# EAGLE design Omnia_SecondBoard (EAGLE 9.7.0)
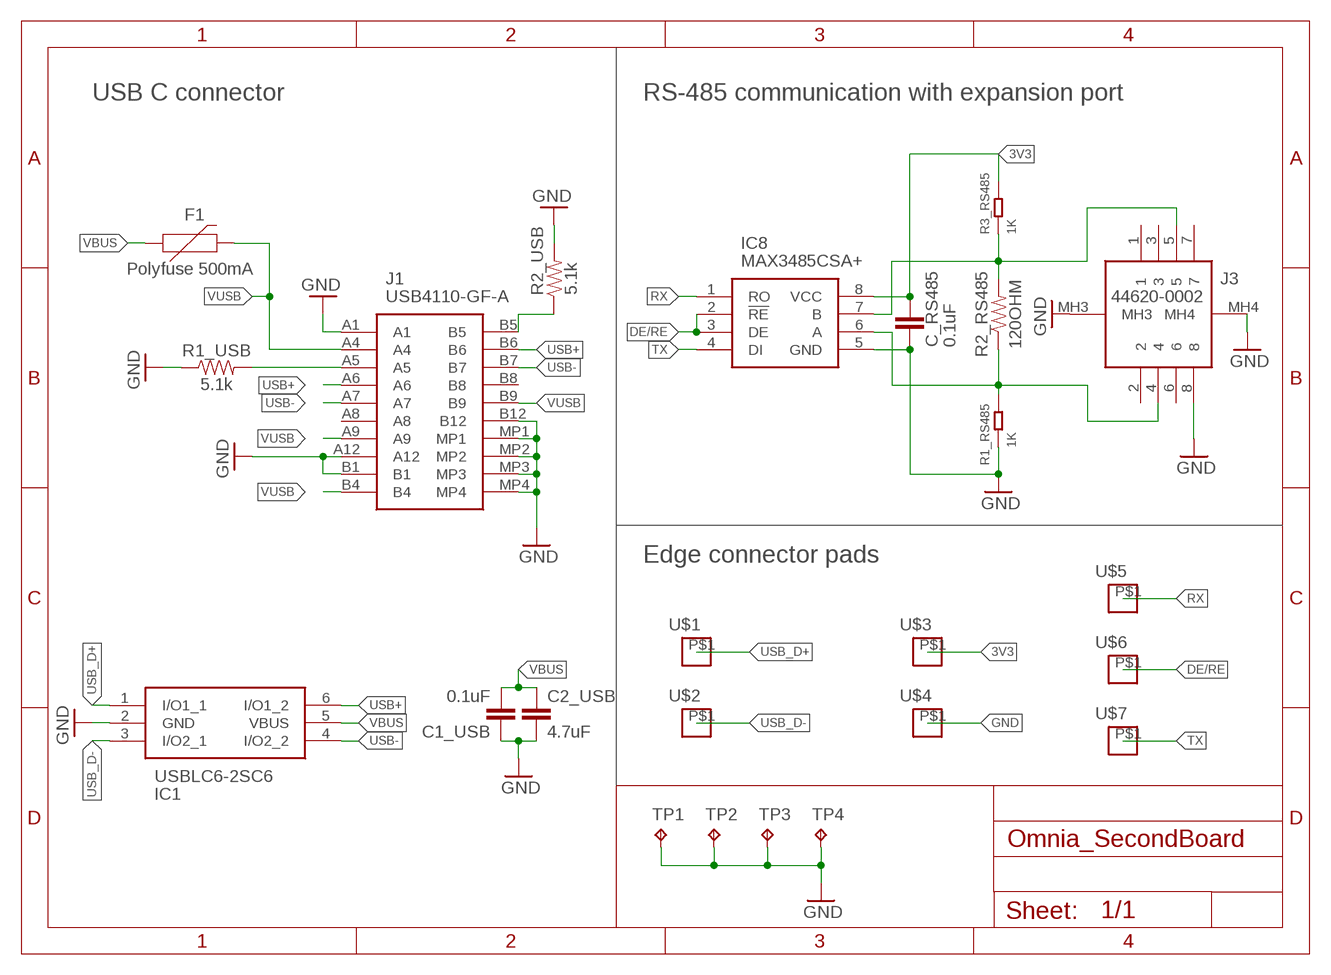
[diagram p0: schematic, sheet 1]

## Parts
C1_USB  0.1uF  0.1UF-0402-16V-10%  [0402]
C2_USB  4.7uF  4.7UF-0603-6.3V-(10%)  [0603]
C_RS485  0.1uF  0.1UF-0402-16V-10%  [0402]
F1  Polyfuse 500mA  PPTC_16V_2.5A  [1812]
IC1  USBLC6-2SC6  [SOT95P280X145-6N]
IC8  MAX3485CSA+  [SOIC127P600X175-8N]
J1  USB4110-GF-A  [USB4110GFA]
J3  44620-0002  [446200002]
R1_RS485  1K  SMD-RES-1K-1%-1/10W(0603)  [R0603]
R1_USB  5.1k  5.1KOHM-0402T-1/16W-1%  [0402-TIGHT]
R2_RS485  120OHM  [0603]
R2_USB  5.1k  5.1KOHM-0402T-1/16W-1%  [0402-TIGHT]
R3_RS485  1K  SMD-RES-1K-1%-1/10W(0603)  [R0603]
TP1  TPTP20SQ  [TP20SQ]
TP2  TPTP20SQ  [TP20SQ]
TP3  TPTP20SQ  [TP20SQ]
TP4  TPTP20SQ  [TP20SQ]
U$1  CUTOUT3  [CUTOUT2]
U$2  CUTOUT3  [CUTOUT2]
U$3  CUTOUT3  [CUTOUT2]
U$4  CUTOUT3  [CUTOUT2]
U$5  CUTOUT3  [CUTOUT2]
U$6  CUTOUT3  [CUTOUT2]
U$7  CUTOUT3  [CUTOUT2]

## Nets
3V3: C_RS485.1 IC8.8(VCC) R3_RS485.2 U$3.P$1(PINHD)
DE/RE: IC8.2(!RE) IC8.3(DE) U$6.P$1(PINHD)
GND: C1_USB.1 C2_USB.2 C_RS485.2 IC1.2(GND) IC8.5(GND) J1.A1 J1.A12 J1.B1 J1.B12 J1.MP1 J1.MP2 J1.MP3 J1.MP4 J3.8 J3.MH3 J3.MH4 R1_RS485.1 R1_USB.1 R2_USB.2 TP1.TP TP2.TP TP3.TP TP4.TP U$4.P$1(PINHD)
N$25: J1.B5 R2_USB.1
N$26: J1.A5 R1_USB.2
N$70: IC8.7(B) J3.5 R2_RS485.2 R3_RS485.1
N$75: IC8.6(A) J3.4 R1_RS485.2 R2_RS485.1
RX: IC8.1(RO) U$5.P$1(PINHD)
TX: IC8.4(DI) U$7.P$1(PINHD)
USB+: IC1.6(I/O1_2) J1.A6 J1.B6
USB-: IC1.4(I/O2_2) J1.A7 J1.B7
USB_D+: IC1.1(I/O1_1) U$1.P$1(PINHD)
USB_D-: IC1.3(I/O2_1) U$2.P$1(PINHD)
VBUS: C1_USB.2 C2_USB.1 F1.1 IC1.5(VBUS)
VUSB: F1.2 J1.A4 J1.A9 J1.B4 J1.B9
Unconnected: J1.A8 J1.B8 J3.1 J3.2 J3.3 J3.6 J3.7

## Notes on the sheet
- USB C connector | RS-485 communication with expansion port
- Edge connector pads

## Library data of the parts
C1_USB C_RS485 = SparkFun-Capacitors:0.1UF: 0.1µF ceramic capacitors A capacitor is a passive two-terminal electrical component used to store electrical energy temporarily in an electric field.; PROD_ID: CAP-12416
C2_USB = SparkFun-Capacitors:4.7UF: 4.7µF ceramic capacitors A capacitor is a passive two-terminal electrical component used to store electrical energy temporarily in an electric field.; PROD_ID: CAP-08280
F1 = SparkFun-Fuses:PPTC: Resettable Fuse PPTC Resettable Fuse. Really a sort of resistor with a polymeric positive temperature coefficient whose resistance increases dramatically with an increase in temperature. When heated by the power passing through the resistance rises causing the current to be limited, protecting the circuit. This is achieved by the transition of the polymer from a crystalline to an amorphous state where the conductive carbon separates breaking the conductive pathways found in the cool crystalline structure. When a PPTC cools back down it resumes conducting letting the circuit turn back on. SparkFun Products: SparkFun RedBoard - Programmed with Arduino <https://www.sparkfun.com/products/12757> Pro Micro - 5V/16MHz <https://www.sparkfun.com/products/12640> Arduino Pro 328 - 5V/16MHz <https://www.sparkfun.com/products/10915> MP3 Trigger <https://www.sparkfun.com/products/13720>; PROD_ID: RES-14390; VALUE: 16V/2.5A(5A TRIP)
IC1 = USBLC6-2SC6:USBLC6-2SC6: TVS Diode Array Uni-Directional USBLC6-2SC6 17V, SOT-23 6-Pin Source: Datasheet <http://www.st.com/st-web-ui/static/active/en/resource/technical/document/datasheet/CD00050750.pdf>; DESCRIPTION: TVS Diode Array Uni-Directional USBLC6-2SC6 17V, SOT-23 6-Pin; HEIGHT: 1.45mm; MANUFACTURER_NAME: STMicroelectronics; MANUFACTURER_PART_NUMBER: USBLC6-2SC6; MOUSER_PART_NUMBER: 511-USBLC6-2SC6; MOUSER_PRICE-STOCK: https://www.mouser.co.uk/ProductDetail/STMicroelectronics/USBLC6-2SC6?qs=po45yt2pPpu%2FhNIlwQdTlg%3D%3D
IC8 = MAX3485CSA+:MAX3485CSA+: MAX3485CSA+, Line Transceiver, RS-485, RS-422 10 Mbit/s Differential, 3.3 V, 8-Pin SOIC Source: Datasheet <http://datasheets.maximintegrated.com/en/ds/MAX3483-MAX3491.pdf>; DESCRIPTION: MAX3485CSA+, Line Transceiver, RS-485, RS-422 10 Mbit/s Differential, 3.3 V, 8-Pin SOIC; HEIGHT: 1.75mm; MANUFACTURER_NAME: Analog Devices; MANUFACTURER_PART_NUMBER: MAX3485CSA+
J1 = USB4110-GF-A:USB4110-GF-A: CONN USB 2.0 TYPE-C R/A SMT Source: Datasheet <https://gct.co/files/drawings/usb4110.pdf>; DESCRIPTION: CONN USB 2.0 TYPE-C R/A SMT; HEIGHT: 3.26mm; MANUFACTURER_NAME: GCT (GLOBAL CONNECTOR TECHNOLOGY); MANUFACTURER_PART_NUMBER: USB4110-GF-A; MOUSER_PART_NUMBER: 640-USB4110-GF-A; MOUSER_PRICE-STOCK: https://www.mouser.co.uk/ProductDetail/GCT/USB4110-GF-A?qs=KUoIvG%2F9IlYiZvIXQjyJeA%3D%3D
J3 = 44620-0002:44620-0002: Molex Female Cat3 RJ45 Modular Jack, Right Angle, Through Hole Mount, 44620 Source: Datasheet <https://componentsearchengine.com/Datasheets/1/44620-0002.pdf>; DESCRIPTION: Molex Female Cat3 RJ45 Modular Jack, Right Angle, Through Hole Mount, 44620; HEIGHT: 13.46mm; MANUFACTURER_NAME: Molex; MANUFACTURER_PART_NUMBER: 44620-0002; MOUSER_PART_NUMBER: 538-44620-0002; MOUSER_PRICE-STOCK: https://www.mouser.co.uk/ProductDetail/Molex/44620-0002?qs=%2F%2FRC%2FV59VWAflICSfNN4Pw%3D%3D
R1_RS485 R3_RS485 = OPL_Resistor:SMD-RES-1K-1%-1/10W(0603): 301011969; MPN: RC0603FR-071KL
R1_USB R2_USB = SparkFun-Resistors:5.1KOHM; PROD_ID: RES-14340
R2_RS485 = SparkFun-Resistors:120OHM: 120Ω resistor A resistor is a passive two-terminal electrical component that implements electrical resistance as a circuit element. Resistors act to reduce current flow, and, at the same time, act to lower voltage levels within circuits. - Wikipedia
TP1-TP4 = testpad:TP: Test pad
U$1-U$7 = Library_cutout:CUTOUT3

## Board
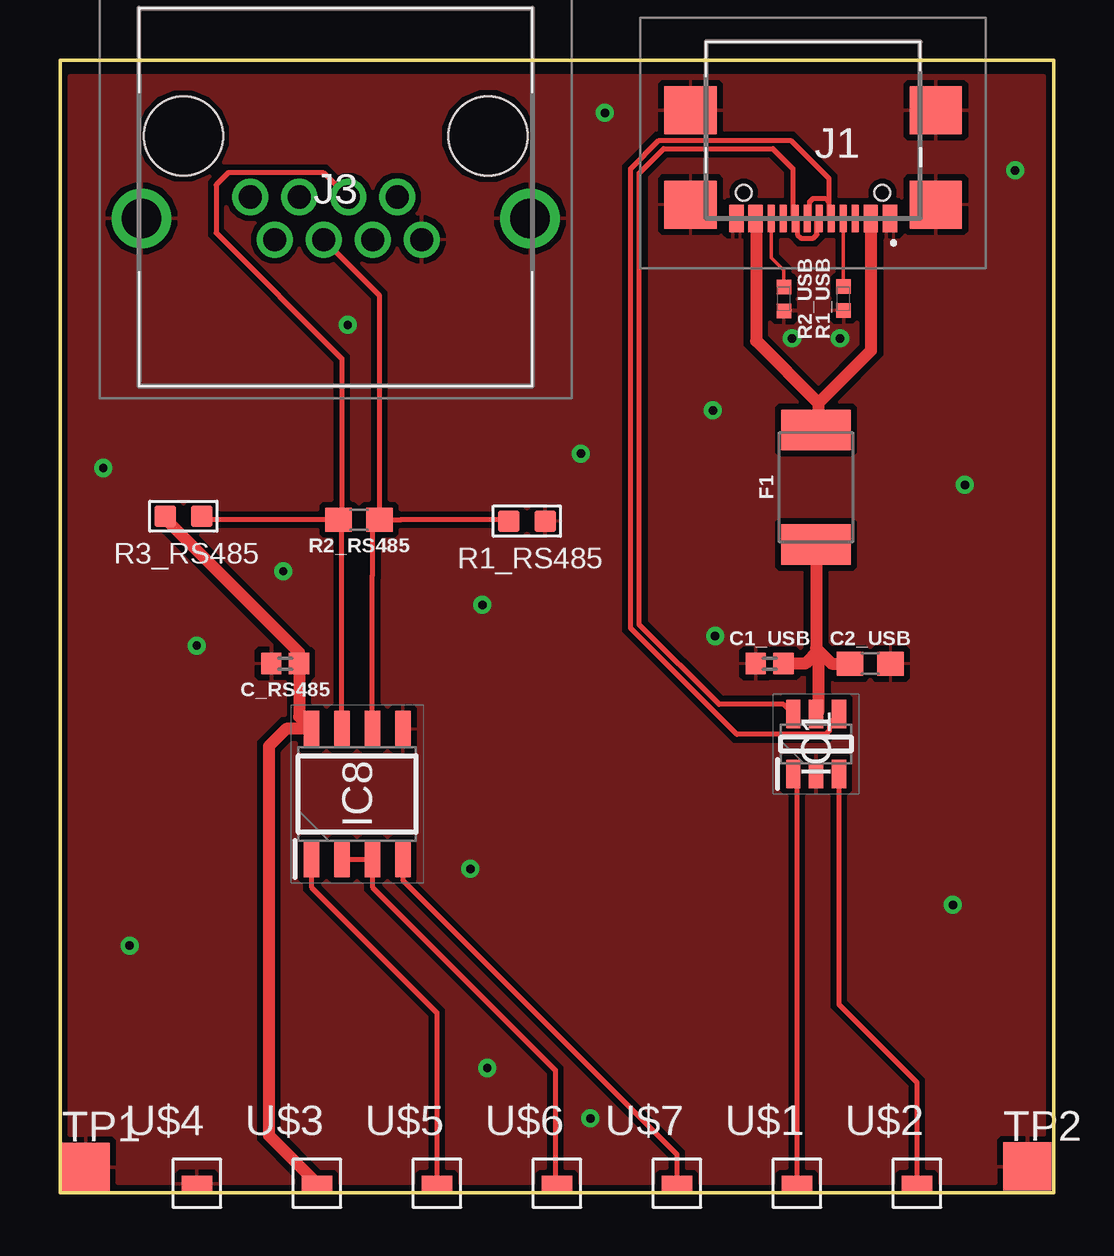
[diagram p1: board, top side]
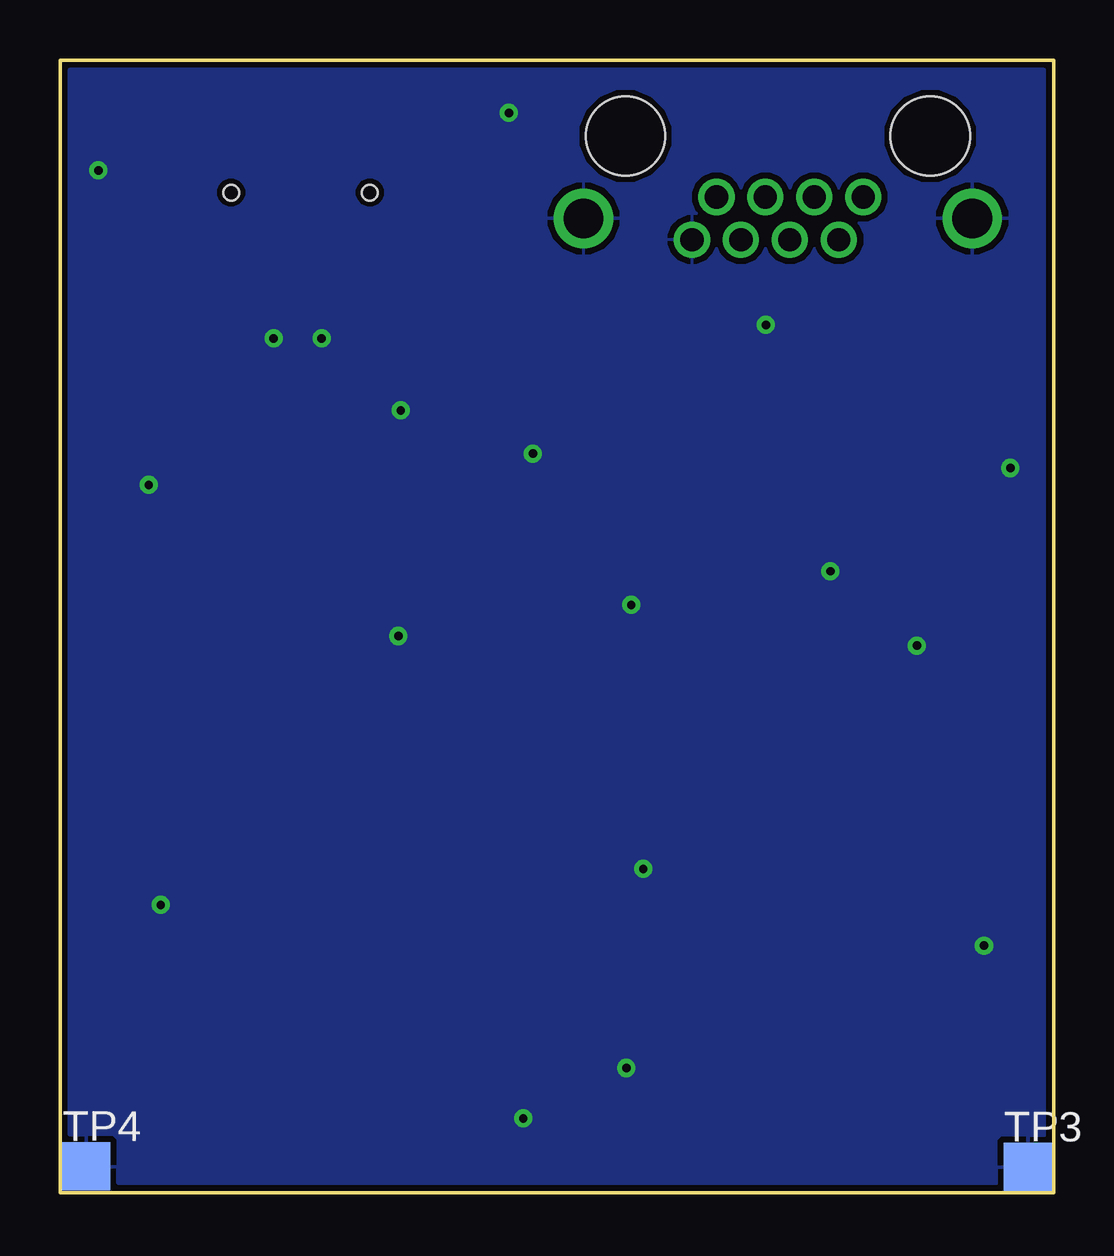
[diagram p2: board, bottom side, seen from below]

Size 41.4 x 47.2 mm. Coordinates in mm from the lower left corner, seen from the top.
Outline: 0,47.2 0,0 41.4,0 41.4,47.2 0,47.2
Copper layers (1*16): Top / Bottom
Stack-up Default Layer Stack: Top User Defined 0.035mm / Dielectric-1 User Defined 1.5mm / Bottom User Defined 0.035mm
Design rules: minimum copper width 6mil, minimum drill size 0.35mm, copper clearance wire_polygon to wire_polygon 6mil, copper clearance wire_polygon to pad_smd 6mil, copper clearance wire_polygon to via 6mil, copper clearance pad_smd to pad_smd 0.152mm, copper clearance pad_smd to via 6mil, copper clearance via to via 6mil, copper clearance smd to pad (same net) 6mil, copper clearance smd to via (same net) 6mil, copper clearance smd to smd (same net) 6mil, dimension clearance 6mil, via restrict clearance 6mil, restrict clearance 6mil, drill distance 6mil, keepout clearance 6mil

### Footprints (pad centres in the part's own frame; a part is rotated, then mirrored left to right if it is on the bottom)
0402 = smd 0.85 x 0.9: 1 -0.58,0; 2 0.58,0
0603 = smd 1.1 x 1: 1 -0.85,0; 2 0.85,0
1812 = smd 1.676 x 2.896: 1 -2.388,0; 2 2.388,0
SOT95P280X145-6N = smd 1.2 x 0.6: 1 -1.25,0.95; 2 -1.25,0; 3 -1.25,-0.95; 4 1.25,-0.95; 5 1.25,0; 6 1.25,0.95
SOIC127P600X175-8N = smd 1.525 x 0.65: 1 -2.712,1.905; 2 -2.712,0.635; 3 -2.712,-0.635; 4 -2.712,-1.905; 5 2.712,-1.905; 6 2.712,-0.635; 7 2.712,0.635; 8 2.712,1.905
USB4110GFA = smd 0.3 x 1.15: A1 -3.35,3.678; A4 -2.55,3.678; A5 -1.25,3.678; A6 -0.25,3.678; A7 0.25,3.678; A8 1.25,3.678; A9 2.55,3.678; A12 3.35,3.678; B1 3.05,3.678; B4 2.25,3.678; B5 1.75,3.678; B6 0.75,3.678; B7 -0.75,3.678; B8 -1.75,3.678; B9 -2.25,3.678; B12 -3.05,3.678 | smd 2.18 x 2: MP1 -5.11,-0.827; MP2 5.11,-0.827; MP3 -5.11,3.103; MP4 5.11,3.103 | hole 0.65: -2.89,2.603; 2.89,2.603
446200002 = drill 0.97 pad 1.509: 1 0,0; 2 -1.02,1.78; 3 -2.04,0; 4 -3.06,1.78; 5 -4.08,0; 6 -5.1,1.78; 7 -6.12,0; 8 -7.14,1.78 | drill 1.65 pad 2.475: MH3 4.54,0.89; MH4 -11.66,0.89 | hole 3.3: 2.79,-2.54; -9.91,-2.54
R0603 = smd 0.889 x 0.889: 1 0,0.762; 2 0,-0.762
0402-TIGHT = smd 0.6 x 0.6: 1 -0.5,0; 2 0.5,0
TP20SQ = smd 2 x 2: TP 0,0
CUTOUT2 = smd 1.27 x 0.635: P$1 0,0

### Placement (x,y rotation side)
C1_USB  29.57,22.05 0 top
C2_USB  33.76,22.05 0 top
C_RS485  9.38,22.05 180 top
F1  31.5,29.4 90 top
IC1  31.5,18.7 90 top
IC8  12.38,16.62 90 top
J1  31.38,44.28 180 top
J3  7.93,41.49 180 top
R1_RS485  19.46,27.99 270 top
R1_USB  32.64,37.26 90 top
R2_RS485  12.46,28.05 180 top
R2_USB  30.16,37.25 270 top
R3_RS485  5.14,28.19 270 top
TP1  1.08,1.08 0 top
TP2  40.3,1.1 0 top
TP3  1.08,1.08 0 bottom
TP4  40.3,1.1 0 bottom
U$1  30.7,0.39 0 top
U$2  35.7,0.39 0 top
U$3  10.7,0.39 0 top
U$4  5.7,0.39 0 top
U$5  15.7,0.39 0 top
U$6  20.7,0.39 0 top
U$7  25.7,0.39 0 top

### Tracks (layer width: path | path; a pad name or v marks a point on that pad's centre or on a via)
3V3
  Top 0.508: R3_RS485.2 4.38,28.09 9.96,22.51 C_RS485.1 9.96,19.85 IC8.8 9.43,19.33 8.7,18.6 8.7,2.39 U$3.P$1
DE/RE
  Top 0.2: IC8.2 IC8.3 13.02,12.73 20.64,5.11 20.64,0.46 U$6.P$1
GND  (via drill 0.35)
  Top 0.2: J1.A12 J1.B1
  other vias: 32.5,35.6 30.5,35.6 27.3,23.2 17.6,24.5 17.1,13.5 5.7,22.8 17.8,5.2 22.1,3.1 9.3,25.9 2.9,10.3 37.2,12 37.7,29.5 27.2,32.6 21.7,30.8 1.8,30.2 39.8,42.6 22.7,45 11.99,36.16
  pour Top (isolate 0.254): -0.3,46.6 -0.3,-0.4 41.7,-0.4 41.7,46.6
  pour Bottom (isolate 0.254): 0.1,48.6 0.1,0 41,0 41.3,0.3 41.3,47.5 40.8,48
N$25
  Top 0.152: J1.B5 29.63,38.97 30.16,38.44 R2_USB.1
N$26
  Top 0.152: J1.A5 R1_USB.2
N$70
  Top 0.2: IC8.7 11.74,27.92 | 11.74,27.92 R2_RS485.2 6.04,28.05 R3_RS485.1 | J3.5 11.99,41.49 10.99,42.5 7,42.5 6.5,42 6.5,40 11.74,34.76 11.74,27.92
N$75
  Top 0.2: R1_RS485.2 18.64,28.04 14.22,28.04 14.22,28.05 R2_RS485.1 | J3.4 13.31,37.39 R2_RS485.1 | IC8.6 13.02,25.72 13.03,25.74 13.03,27.77 R2_RS485.1
RX
  Top 0.2: IC8.1 10.47,12.73 15.7,7.51 U$5.P$1
TX
  Top 0.2: IC8.4 14.29,13.02 25.7,1.6 U$7.P$1
USB+
  Top 0.2: IC1.6 30.15,20.35 27.46,20.35 24.13,23.68 24.13,42.48 25.15,43.5 29.7,43.5 30.53,42.67 30.53,40.7 J1.B6 30.73,40.51 30.73,39.92 30.88,39.78 31.38,39.78 31.53,39.92 31.53,40.51 J1.A6
USB-
  Top 0.2: 32.03,41.28 31.88,41.43 31.38,41.43 31.23,41.28 31.23,40.7 J1.A7 | J1.B7 32.03,40.7 32.03,41.28 | IC1.4 32.05,19.55 32.05,19.25 31.91,19.1 28.2,19.1 23.78,23.52 23.78,39.83 23.77,39.83 23.77,42.67 24.95,43.86 30.45,43.86 32.03,42.27 32.03,41.28
USB_D+
  Top 0.2: IC1.1 30.7,17.3 U$1.P$1
USB_D-
  Top 0.2: IC1.3 32.45,7.85 35.7,4.6 U$2.P$1
VBUS
  Top 0.508: 31.6,22.6 31.6,20.05 IC1.5 | 31.6,22.6 31.05,22.05 C1_USB.2 | 31.6,22.6 32.15,22.05 C2_USB.1 | F1.1 31.5,22.7 31.6,22.6
VUSB
  Top 0.15: J1.B9 J1.A4 33.8,40.47 | J1.A9 J1.B4 29,40.47
  Top 0.508: 33.8,40.47 33.8,35.1 31.6,32.9 | 29,40.47 29,35.5 31.6,32.9 | 31.6,32.9 31.6,31.89 F1.2